# EAGLE design 601_motor_arduino (EAGLE 9.6.2)
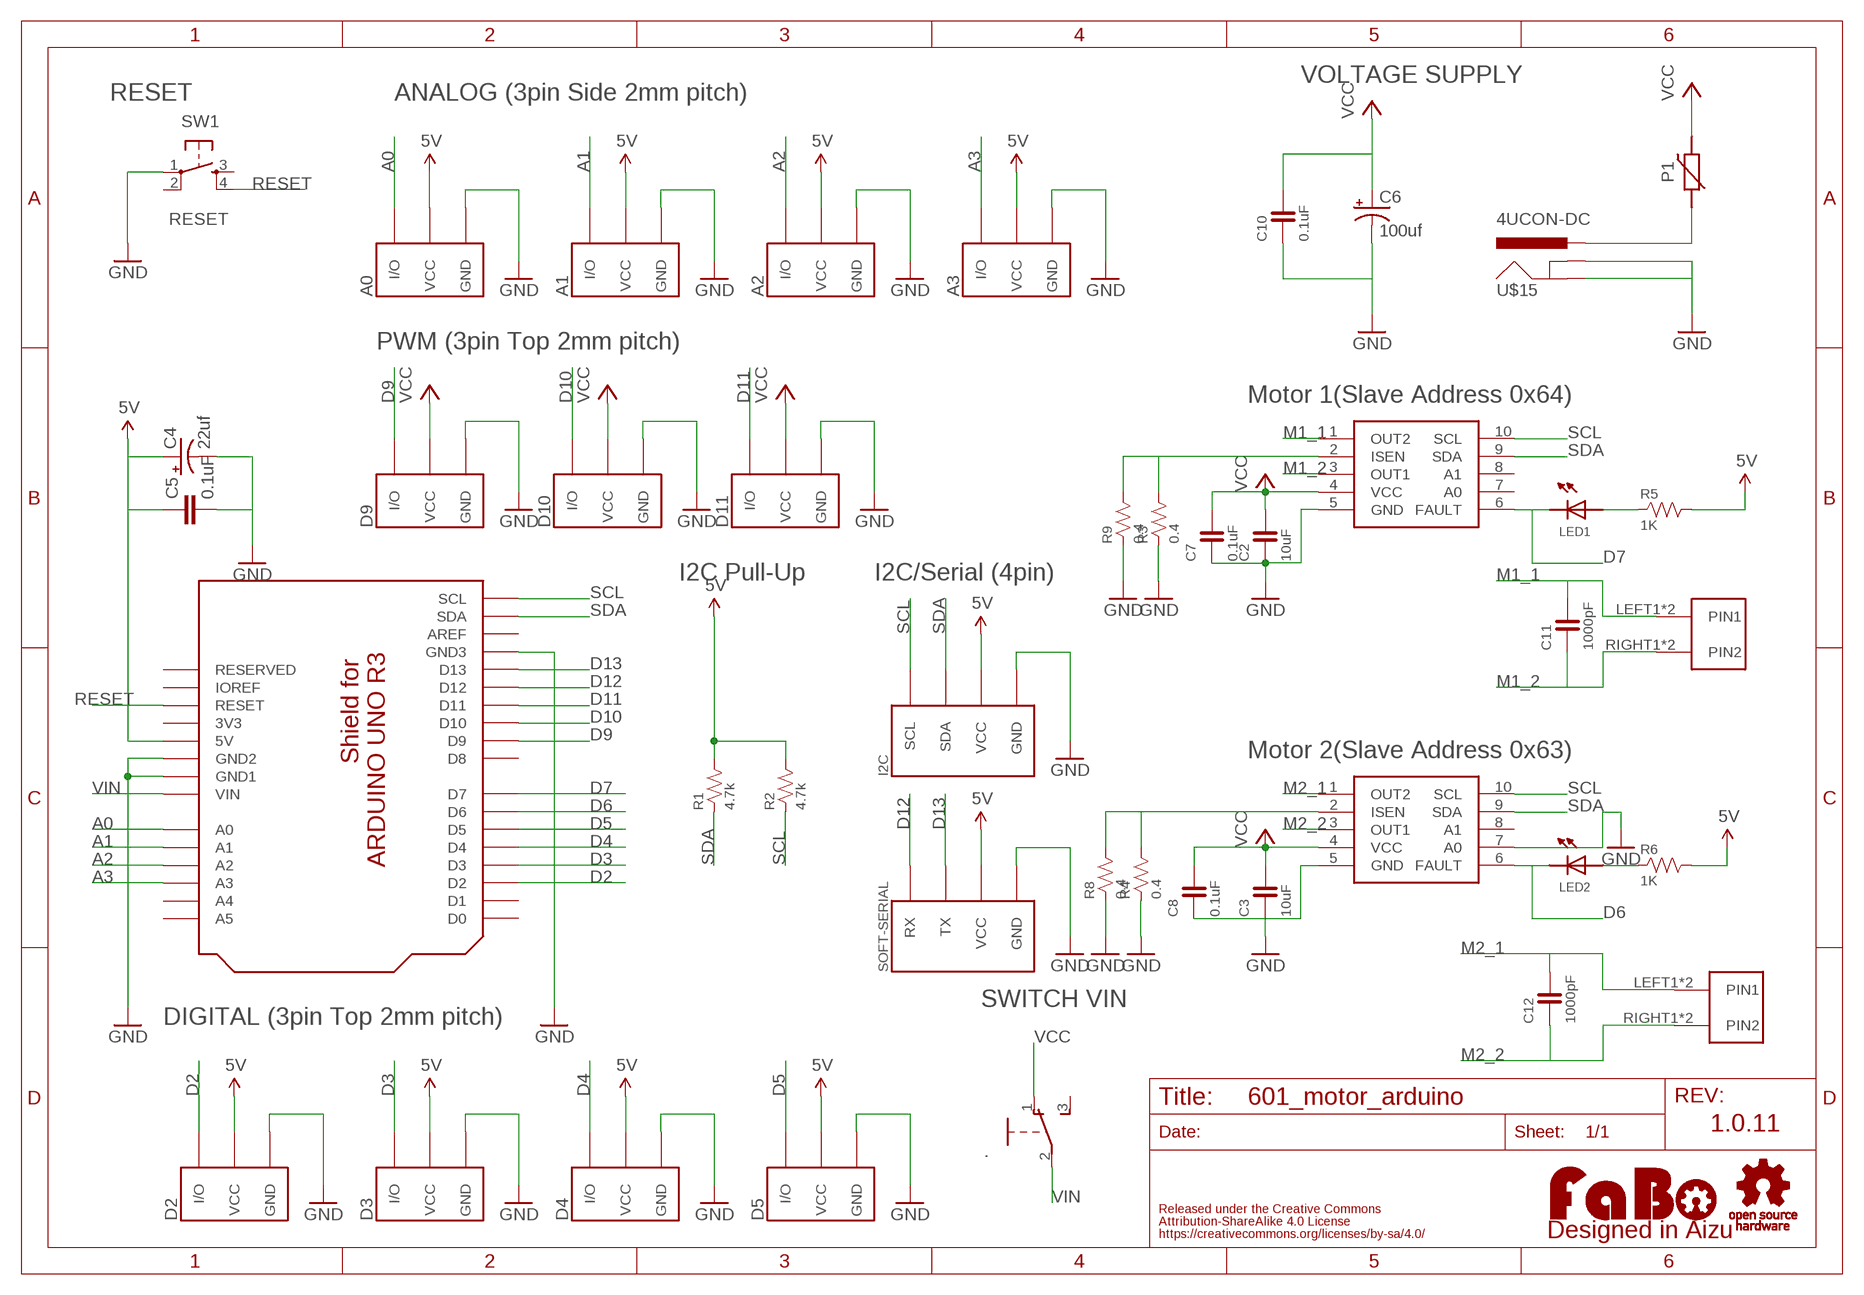
[diagram p0: schematic, sheet 1]

## Parts
.  SLIDE-EG1218  [EG1218]
A0  FABO_BRICK_3PIN-S03B-PASK-2  [FABO_BRICK_3PIN_S03B-PASK-2]
A1  FABO_BRICK_3PIN-S03B-PASK-2  [FABO_BRICK_3PIN_S03B-PASK-2]
A2  FABO_BRICK_3PIN-S03B-PASK-2  [FABO_BRICK_3PIN_S03B-PASK-2]
A3  FABO_BRICK_3PIN-S03B-PASK-2  [FABO_BRICK_3PIN_S03B-PASK-2]
C2  10uF  CAPACITOR-0603  [0603]
C3  10uF  CAPACITOR-0603  [0603]
C4  22uf  CPOL-US153CLV-0405  [153CLV-0405]
C5  0.1uF  CAP-EIA0603  [EIA0603]
C6  100uf  CPOL-US153CLV-0405  [153CLV-0405]
C7  0.1uF  CAPACITOR-0603  [0603]
C8  0.1uF  CAPACITOR-0603  [0603]
C10  0.1uF  CAPACITOR-0603  [0603]
C11  1000pF  CAPACITOR-0603  [0603]
C12  1000pF  CAPACITOR-0603  [0603]
D2  FABO_BRICK_3PIN-B03B-PASK-1  [FABO_BRICK_3PIN_B03B-PASK-1]
D3  FABO_BRICK_3PIN-B03B-PASK-1  [FABO_BRICK_3PIN_B03B-PASK-1]
D4  FABO_BRICK_3PIN-B03B-PASK-1  [FABO_BRICK_3PIN_B03B-PASK-1]
D5  FABO_BRICK_3PIN-B03B-PASK-1  [FABO_BRICK_3PIN_B03B-PASK-1]
D9  FABO_BRICK_3PIN-HEADER  [FABO_BRICK_3PIN_HEADER]
D10  FABO_BRICK_3PIN-HEADER  [FABO_BRICK_3PIN_HEADER]
D11  FABO_BRICK_3PIN-HEADER  [FABO_BRICK_3PIN_HEADER]
I2C  FABO_BRICK_I2C-S04B-PASK-2  [FABO_BRICK_I2C_S04B-PASK-2]
LED1  LED-0603  [0603]
LED2  LED-0603  [0603]
LOGO1  LOGO_FABO-M  [LOGO_FABO_M]
P1  POLYSWITCHMF-NSML1  [1206]
R1  4.7k  RESISTOR-0603  [0603]
R2  4.7k  RESISTOR-0603  [0603]
R3  0.4  RESISTOR-0603  [0603]
R4  0.4  RESISTOR-0603  [0603]
R5  1K  RESISTOR-0603  [0603]
R6  1K  RESISTOR-0603  [0603]
R8  0.4  RESISTOR-0603  [0603]
R9  0.4  RESISTOR-0603  [0603]
SOFT-SERIAL  FABO_BRICK_SERIAL-S04B-PASK-2  [FABO_BRICK_SERIAL_S04B-PASK-2]
SW1  RESET  SWITCH-TACT-6MM  [DTS_6_V]
U1  ARDUINO_UNO_R3_SHIELD-NOLABEL  [ARDUINO_UNO_R3_NOLABEL]
U$6  LOGO_OSHW-T_M  [LOGO_OSHW_T_MS]
U$8  DRV8830  [DRV8830]
U$10  DRV8830  [DRV8830]
U$12  ML-1400-S1  [ML-1400-S1]
U$13  ML-1400-S1  [ML-1400-S1]
U$15  4UCON-DC  [4UCON-DC]

## Nets
5V: A0.VCC A1.VCC A2.VCC A3.VCC C4.+ C5.1 D2.VCC D3.VCC D4.VCC D5.VCC I2C.VCC R1.2 R2.2 R5.2 R6.2 SOFT-SERIAL.VCC U1.5V
A0: A0.I/O U1.A0
A1: A1.I/O U1.A1
A2: A2.I/O U1.A2
A3: A3.I/O U1.A3
D2: D2.I/O U1.D2
D3: D3.I/O U1.D3
D4: D4.I/O U1.D4
D5: D5.I/O U1.D5
D6: LED2.CATHODE U1.D6 U$10.6(FAULT)
D7: LED1.CATHODE U1.D7 U$8.6(FAULT)
D9: D9.I/O U1.D9
D10: D10.I/O U1.D10
D11: D11.I/O U1.D11
D12: SOFT-SERIAL.RX U1.D12
D13: SOFT-SERIAL.TX U1.D13
GND: A0.GND A1.GND A2.GND A3.GND C2.1 C3.1 C4.- C5.2 C6.- C7.1 C8.1 C10.1 D2.GND D3.GND D4.GND D5.GND D9.GND D10.GND D11.GND I2C.GND R3.1 R4.1 R8.1 R9.1 SOFT-SERIAL.GND SW1.1 U1.GND1 U1.GND2 U1.GND3 U$8.5(GND) U$10.5(GND) U$10.7(A0) U$15.GND1(GND) U$15.GND2(GNDBREAK)
M1_1: C11.2 U$8.1(OUT2) U$12.LEFT1(PIN1) U$12.LEFT2(PIN1)
M1_2: C11.1 U$8.3(OUT1) U$12.RIGHT1(PIN2) U$12.RIGHT2(PIN2)
M2_1: C12.2 U$10.1(OUT2) U$13.LEFT1(PIN1) U$13.LEFT2(PIN1)
M2_2: C12.1 U$10.3(OUT1) U$13.RIGHT1(PIN2) U$13.RIGHT2(PIN2)
N$1: P1.P$1 U$15.VCC(PWR)
N$3: R3.2 R9.2 U$8.2(ISEN)
N$4: R4.2 R8.2 U$10.2(ISEN)
N$5: LED1.ANODE R5.1
N$6: LED2.ANODE R6.1
RESET: SW1.4 U1.RESET
SCL: I2C.SCL R2.1 U1.SCL U$8.10(SCL) U$10.10(SCL)
SDA: I2C.SDA R1.1 U1.SDA U$8.9(SDA) U$10.9(SDA)
VCC: ..1 C2.2 C3.2 C6.+ C7.2 C8.2 C10.2 D9.VCC D10.VCC D11.VCC P1.P$2 U$8.4(VCC) U$10.4(VCC)
VIN: ..2 U1.VIN
Unconnected: ..3 SW1.2 SW1.3 U1.A4 U1.A5 U1.AREF U1.D0 U1.D1 U1.D8 U1.IOREF U1.RESERVED U$8.7(A0) U$8.8(A1) U$10.8(A1)

## Notes on the sheet
- VOLTAGE SUPPLY
- RESET | ANALOG (3pin Side 2mm pitch)
- PWM (3pin Top 2mm pitch)
- Motor 1(Slave Address 0x64)
- I2C Pull-Up | I2C/Serial (4pin)
- Motor 2(Slave Address 0x63)
- SWITCH VIN
- DIGITAL (3pin Top 2mm pitch)
- 1.0.11

## Power pins joined to a net without a drawn wire
3V3: U1.3V3

## Library data of the parts
. = FaBo-Switch:SLIDE
A0 A1-A3 D2-D5 D9-D11 = FaBo-Template:FABO_BRICK_3PIN: FaBo Brick 3pin
C2 C3 C7 C8 C10-C12 = FaBo-Capacitor:CAPACITOR: CAPACITOR
C4 C6 = resistor:CPOL-US: POLARIZED CAPACITOR, American symbol
C5 = FaBo-etc:CAP: Capacitor Standard 0603 ceramic capacitor
I2C = FaBo-Template:FABO_BRICK_I2C: FaBo Brick I2C
LED1 LED2 = FaBo-LED:LED
LOGO1 = component:LOGO_FABO
P1 = FaBo-Supply:POLYSWITCH
R1-R6 R8 R9 = FaBo-Resistors:RESISTOR: RESISTOR
SOFT-SERIAL = FaBo-Template:FABO_BRICK_SERIAL: FaBo Brick Serial
SW1 = FaBo-etc:SWITCH-TACT
U1 = FaBo-Boards:ARDUINO_UNO_R3_SHIELD
U$6 = FaBo-etc:LOGO_OSHW
U$8 U$10 = FaBo-Motor:DRV8830
U$12 U$13 = FaBo-Terminal:ML-1400-S1
U$15 = FaBo-Supply:4UCON-DC

## Board
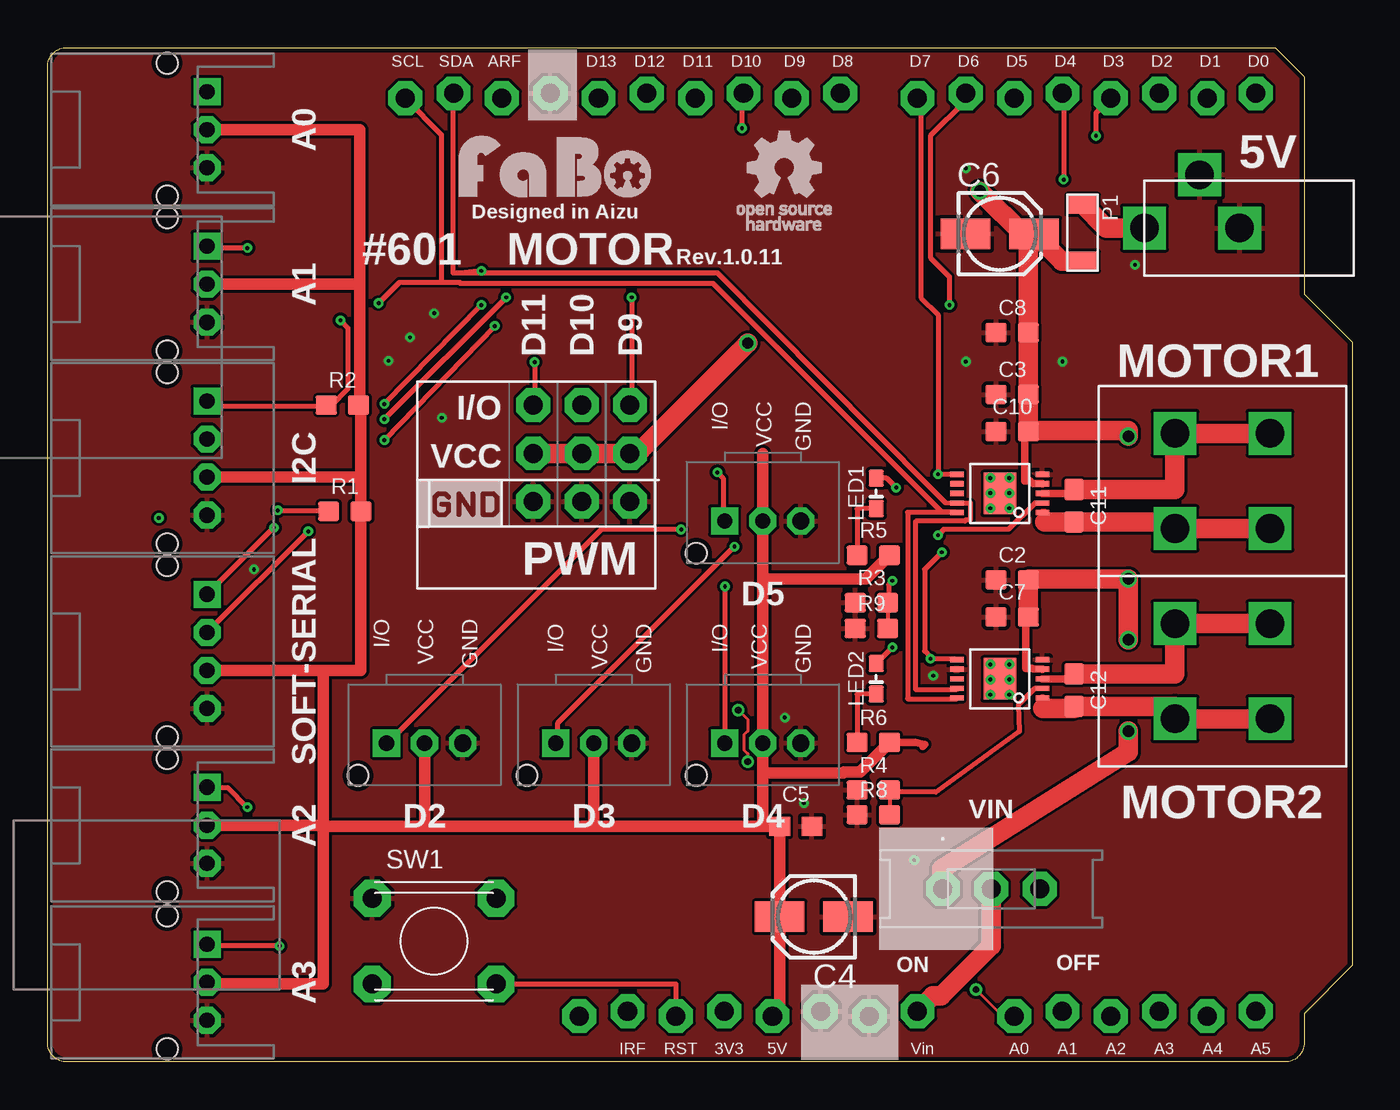
[diagram p1: board, top side]
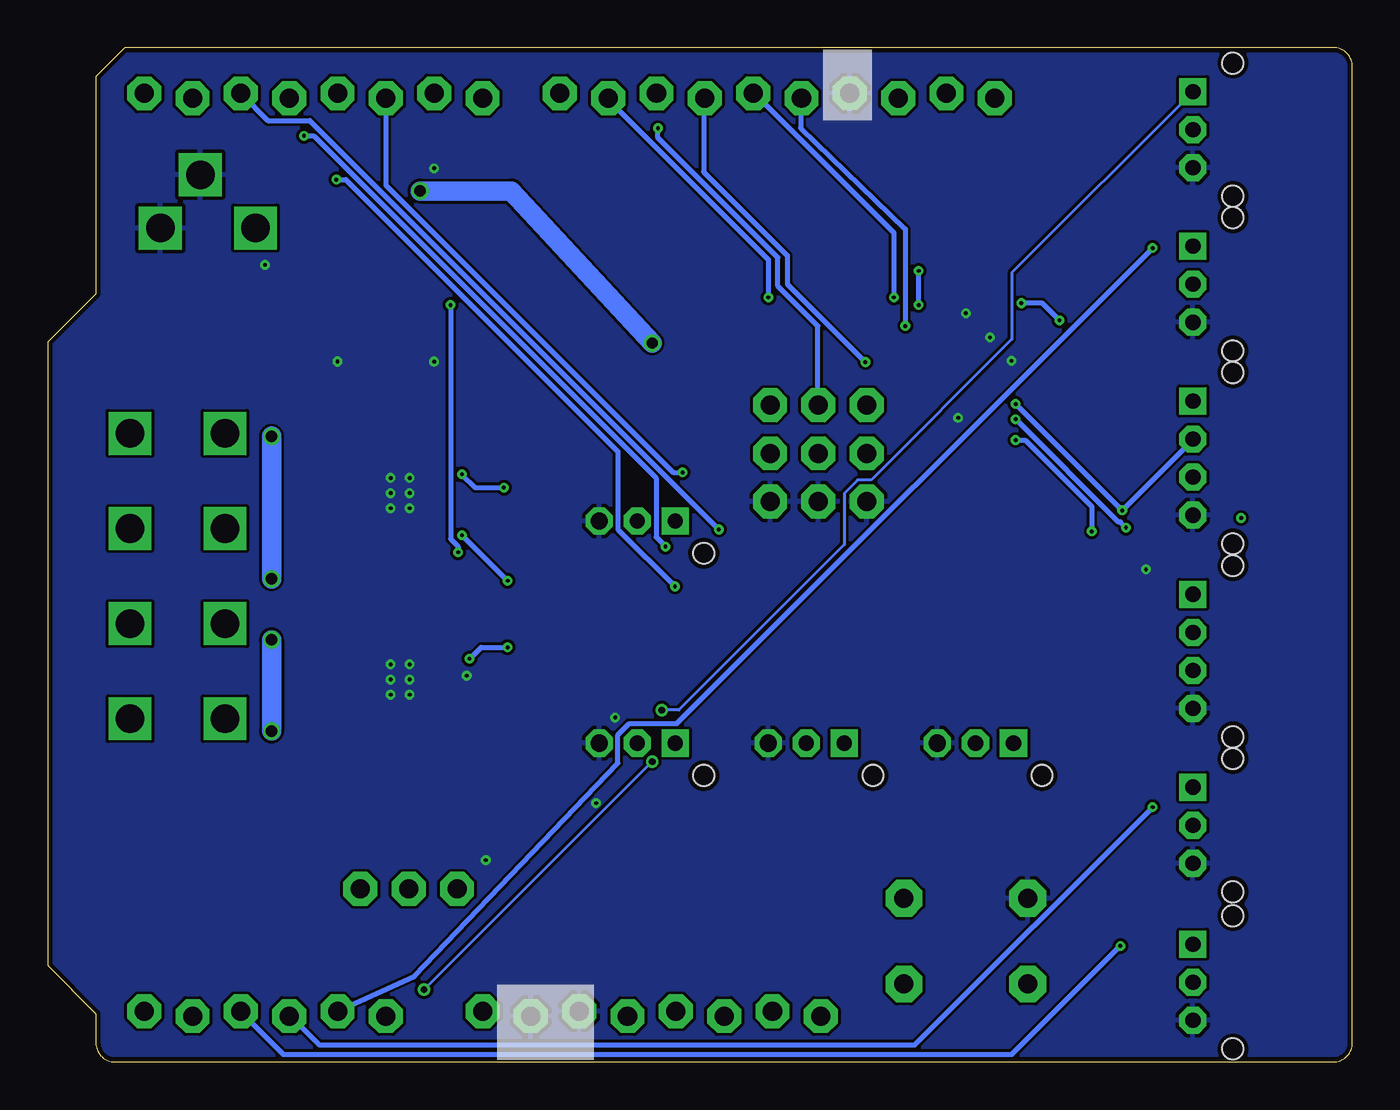
[diagram p2: board, bottom side, seen from below]

Size 68.58 x 53.34 mm. Coordinates in mm from the lower left corner, seen from the top.
Copper layers (1*16): Top 0.035mm / dielectric 1.6mm / Bottom 0.035mm
Design rules "PCBway": minimum track width 6mil, minimum drill 12mil, track to track 6mil, track to pad 6mil, pad to pad 6mil, via to via 6mil, smd to smd 6mil, copper to edge 10mil, drill to drill 10mil, minimum pad ring 10mil, minimum via ring 6mil, stop-mask expansion 2mil, vias tented up to drill 100mil, thermal gap 8mil

### Footprints (pad centres in the part's own frame; a part is rotated, then mirrored left to right if it is on the bottom)
EG1218 = drill 1 pad 1.778 octagon: 1 -2.54,0; 2 0,0; 3 2.54,0
FABO_BRICK_3PIN_S03B-PASK-2 = drill 0.8 pad 1.422 octagon: GND -2,0; VCC 0,0 | drill 0.8 pad 1.422 square: I/O 2,0 | hole 1.1: 3.5,2.1; -3.5,2.1
0603 = smd 1.1 x 1: 1 -0.85,0; 2 0.85,0
153CLV-0405 = smd 2.6 x 1.6: + 1.8,0; - -1.8,0
EIA0603 = smd 1.1 x 1: 1 -0.85,0; 2 0.85,0
FABO_BRICK_3PIN_B03B-PASK-1 = drill 0.9 pad 1.422 octagon: GND -2,0 | drill 0.8 pad 1.422 square: I/O 2,0 | drill 0.8 pad 1.422 octagon: VCC 0,0 | hole 1.1: 3.5,1.7
FABO_BRICK_3PIN_HEADER = drill 1 pad 1.778 octagon: GND -2.54,0; I/O 2.54,0; VCC 0,0
FABO_BRICK_I2C_S04B-PASK-2 = drill 0.8 pad 1.422 octagon: GND -3,0; SDA 1,0; VCC -1,0 | drill 0.8 pad 1.422 square: SCL 3,0 | hole 1.1: 4.5,2.1; -4.5,2.1
0603' = smd 0.9 x 0.8: ANODE -0.8,0; CATHODE 0.8,0
1206 = smd 1 x 1.6: P$1 -1.5,0; P$2 1.5,0
FABO_BRICK_SERIAL_S04B-PASK-2 = drill 0.8 pad 1.422 octagon: GND -3,0; TX 1,0; VCC -1,0 | drill 0.8 pad 1.422 square: RX 3,0 | hole 1.1: 4.5,2.1; -4.5,2.1
DTS_6_V = drill 1 pad 1.93 octagon: 1 -3.25,2.25; 2 3.25,2.25; 3 -3.25,-2.25; 4 3.25,-2.25
ARDUINO_UNO_R3_NOLABEL = drill 1 pad 1.778 octagon: 3V3 35.56,2.667; 5V 38.1,2.413; A0 50.8,2.413; A1 53.34,2.667; A2 55.88,2.413; A3 58.42,2.667; A4 60.96,2.413; A5 63.5,2.667; AREF 23.876,50.673; D0 63.5,50.927; D1 60.96,50.673; D2 58.42,50.927; D3 55.88,50.673; D4 53.34,50.927; D5 50.8,50.673; D6 48.26,50.927; D7 45.72,50.673; D8 41.656,50.927; D9 39.116,50.673; D10 36.576,50.927; D11 34.036,50.673; D12 31.496,50.927; D13 28.956,50.673; GND1 43.18,2.413; GND2 40.64,2.667; GND3 26.416,50.927; IOREF 30.48,2.667; RESERVED 27.94,2.413; RESET 33.02,2.413; SCL 18.796,50.673; SDA 21.336,50.927; VIN 45.72,2.667
DRV8830 = smd 0.27 x 0.7: 1 -1,-2.24; 2 -0.5,-2.24; 3 0,-2.24; 4 0.5,-2.24; 5 1,-2.24; 6 1,2.26; 7 0.5,2.26; 8 0,2.26; 9 -0.5,2.26; 10 -1,2.26 | smd 2.18 x 1.72: P$1 0,0
ML-1400-S1 = drill 1.5 square: LEFT1 -2.5,2.5; LEFT2 -2.5,-2.5; RIGHT1 2.5,2.5; RIGHT2 2.5,-2.5
4UCON-DC = drill 1.5 square: GND1 0.5,0; GND2 2.6,-2.8; VCC 5.5,0

### Placement (x,y rotation side)
.  49.6,9.1 0 top
A0  8.38,49.02 90 top
A1  8.38,40.89 90 top
A2  8.38,12.45 90 top
A3  8.38,4.19 90 top
C2  50.7,25.35 0 top
C3  50.7,35.1 0 top
C4  40.28,7.64 180 top
C5  39.33,12.38 0 top
C6  50.05,43.55 0 top
C7  50.7,23.4 0 top
C8  50.7,38.35 0 top
C10  50.7,33.15 0 top
C11  53.95,29.25 270 top
C12  53.95,19.55 270 top
D2  19.81,16.76 180 top
D3  28.7,16.76 180 top
D4  37.59,16.76 180 top
D5  37.59,28.45 180 top
D9  30.61,32 90 top
D10  28.07,32 90 top
D11  25.53,32 90 top
I2C  8.38,31.75 90 top
LED1  [0603']  43.55,29.9 90 top
LED2  [0603']  43.55,20.15 90 top
LOGO1  26.67,45.09 0 top
P1  54.4,43.6 270 top
R1  15.62,28.96 0 top
R2  15.49,34.54 0 top
R3  43.3,24.15 0 top
R4  43.4,14.3 0 top
R5  43.4,26.65 0 top
R6  43.4,16.8 0 top
R8  43.4,13 0 top
R9  43.3,22.8 0 top
SOFT-SERIAL  8.38,21.59 90 top
SW1  20.32,6.35 0 top
U1  0,0 0 top
U$6  38.73,46.99 0 top
U$8  50.05,29.9 90 top
U$10  50.05,20.15 90 top
U$12  61.75,30.55 90 top
U$13  61.75,20.55 90 top
U$15  63.15,43.85 180 top
U$19  [LOGO_SILK_GND]  20.07,28.07 0 top

### Tracks (layer width: path | path; a pad name or v marks a point on that pad's centre or on a via)
5V
  Top 0.406: 46,16.6 46.1,16.7 45.6,16.8 R6.2
  Top 0.61: U1.5V 38.48,2.41 C4.+ C5.1 37.59,12.38 | 37.59,12.38 37.59,15.2 | 37.59,15.2 D4.VCC 37.59,25.4 | 37.59,12.38 28.7,12.38 | 28.7,12.38 D3.VCC | 28.7,12.38 19.81,12.38 | 19.81,12.38 D2.VCC | 37.59,25.4 D5.VCC 37.59,32 | 37.59,15.2 41.81,15.2 41.87,15.26 42.71,15.26 R6.2 | 37.59,25.4 43,25.4 R5.2 | 14.5,12.38 19.81,12.38 | 14.5,12.38 14.5,4.1 8.38,4.1 A3.VCC | 14.5,12.45 A2.VCC | 14.5,12.45 14.5,12.38 | SOFT-SERIAL.VCC 14.5,20.59 | 14.5,20.59 14.5,12.45 | 14.5,20.59 16.47,20.59 R1.2 16.47,30.75 | 16.47,30.75 16.47,34.54 R2.2 16.4,34.54 16.4,40.89 | I2C.VCC 16.47,30.75 | 16.4,40.89 A1.VCC | A0.VCC 16.4,49.02 16.4,40.89
A0  (via drill 0.35)
  Top 0.152: v48.8,3.8 50.1,2.5 50.8,2.5 U1.A0 | v36.8,15.8 36.8,16.2 36.6,16.4 36.6,17.2 36.8,17.4 36.8,18 v36.3,18.5
  Bottom 0.152: v36.8,15.8 v48.8,3.8 | v36.3,18.5 35.4,18.5 26.7,27.2 26.7,29.9 26,30.6 25.3,30.6 17.9,38 17.9,41.5 8.4,51 A0.I/O
A1  (via drill 0.2)
  Top 0.254: v10.5,42.8 8.4,42.8 A1.I/O
  Bottom 0.254: v10.5,42.8 35.5,17.8 38,17.8 38.6,17.2 38.6,15.7 49.3,4.5 53.3,2.7 U1.A1
A2  (via drill 0.2)
  Top 0.254: v10.5,13.4 9.5,14.4 8.4,14.4 A2.I/O
  Bottom 0.254: v10.5,13.4 23,0.9 54.3,0.9 55.8,2.4 U1.A2
A3  (via drill 0.2)
  Top 0.254: v12.2,6.1 8.4,6.1 A3.I/O
  Bottom 0.254: v12.2,6.1 17.9,0.4 56.2,0.4 58.4,2.6 U1.A3
D2  (via drill 0.2)
  Top 0.254: v33.3,28 29.1,28 17.9,16.8 D2.I/O
  Bottom 0.254: v33.3,28 54.8,49.5 57,49.5 58.4,50.9 U1.D2
D3  (via drill 0.2)
  Top 0.254: v36.1,27.1 26.8,17.8 26.8,16.8 D3.I/O | v55.1,48.7 55.1,49.9 55.8,50.6 U1.D3
  Bottom 0.254: v36.1,27.1 36.6,27.6 36.6,30.7 54.6,48.7 v55.1,48.7
D4  (via drill 0.2)
  Top 0.254: v35.6,25 35.6,16.8 D4.I/O | v53.4,46.4 53.4,50.9 U1.D4
  Bottom 0.254: v35.6,25 38.6,28 38.6,32.1 52.9,46.4 v53.4,46.4
D5  (via drill 0.2)
  Top 0.254: v35.2,31 35.5,30.7 35.5,28.5 D5.I/O
  Bottom 0.254: v35.2,31 35.7,31 50.8,46.1 U1.D5
D6  (via drill 0.2)
  Top 0.254: v44.4,21.8 LED2.CATHODE | U$10.6 47.7,21.2 v46.4,21.2 46.4,21.3 46.1,21.6 46.1,25.9 v47,26.8 | v47.4,39.8 47.4,41.3 46.4,42.3 46.4,48.7 48.2,50.5 48.2,50.9 U1.D6
  Bottom 0.254: v44.4,21.8 45.8,21.8 v46.4,21.2 | v47,26.8 47,27.1 47.4,27.5 v47.4,39.8
D7  (via drill 0.2)
  Top 0.254: LED1.CATHODE 44.1,30.7 v44.6,30.2 | U$8.6 v46.8,30.9 46.8,39.3 45.9,40.2 45.9,50.5 45.8,50.6 U1.D7
  Bottom 0.254: v44.6,30.2 46.1,30.2 v46.8,30.9
D9  (via drill 0.2)
  Top 0.254: v30.7,40.2 30.7,34.6 D9.I/O
  Bottom 0.254: v30.7,40.2 30.7,42.2 39.1,50.6 U1.D9
D10  (via drill 0.2)
  Top 0.254: v36.5,49.1 36.5,50.9 U1.D10
  Bottom 0.254: v36.5,49.1 36.5,48.6 30.2,42.3 30.2,40.8 28.1,38.7 28.1,34.6 D10.I/O
D11  (via drill 0.2)
  Top 0.254: v25.6,36.8 25.6,34.6 D11.I/O
  Bottom 0.254: v25.6,36.8 29.7,40.9 29.7,42.4 34.1,46.8 34.1,50.6 U1.D11
D12  (via drill 0.2)
  Top 0.254: v11.9,28.1 8.4,24.6 SOFT-SERIAL.RX | v24.1,40.2 v17.7,33.8
  Bottom 0.254: v11.9,28.1 12.2,28.4 12.3,28.4 v17.7,33.8 | v24.1,40.2 24.1,43.6 31.4,50.9 U1.D12
D13  (via drill 0.2)
  Top 0.254: v13.7,27.9 8.4,22.6 SOFT-SERIAL.TX | v23.5,38.7 v17.7,32.7
  Bottom 0.254: v13.7,27.9 13.7,29.2 17.2,32.7 v17.7,32.7 | v23.5,38.7 23.5,43.8 29,49.1 29,50.6 U1.D13
GND  (via drill 0.2)
  other vias: 57.15,41.91 53.34,36.83 48.26,36.83 48.26,46.99 20.32,39.37 19.05,38.1 10.85,25.9 49.55,30.71 49.55,29.91 49.55,29.11 50.55,29.11 50.55,29.91 50.55,30.71 50.55,20.91 49.55,20.91 49.55,20.11 50.55,20.11 50.55,19.31 49.55,19.31 46.55,20.31 45.55,10.61 38.75,18.11 17.92,36.87 20.72,33.87 39.75,13.61
  pour Bottom: 0,0 68.58,0 68.58,53.34 0,53.34
  pour Top: 0,0 68.58,0 68.58,53.34 0,53.34
M1_1
  Top 0.406: U$8.1 52.4,28.9 52.4,28.4
  Top 1.016: 52.4,28.4 C11.2 59.25,28.4 U$12.LEFT1 U$12.LEFT2
M1_2
  Top 0.406: U$8.3 53.95,29.9 C11.1
  Top 1.016: C11.1 59.25,30.1 59.25,32.5 | 59.25,32.5 U$12.RIGHT1 | U$12.RIGHT2 U$12.RIGHT1 | U$12.RIGHT1 59.25,32.5
M2_1
  Top 0.406: U$10.1 52.3,18.6 | 53.95,18.6 C12.2
  Top 1.016: 52.3,18.6 53.95,18.6 | C12.2 59.25,18.7 U$13.LEFT1 U$13.LEFT2
M2_2
  Top 0.406: U$10.3 53.95,20.15 C12.1
  Top 1.016: C12.1 59.25,20.4 U$13.RIGHT1 U$13.RIGHT2
N$1
  Top 1.016: U$15.VCC 55.65,43.85 P1.P$1
N$3  (via drill 0.2)
  Top 0.203: R3.2 R9.2
  Top 0.254: v44.4,25.3 44.2,25.1 44.2,24.2 R3.2 | v46.8,27.7 47.1,28 50.5,28 51.9,29.4 U$8.2
  Bottom 0.254: v46.8,27.7 v44.4,25.3
N$4
  Top 0.203: R4.2 R8.2
  Top 0.254: U$10.2 51.9,19.65 51.03,18.78 51.08,17.38 46.7,14.2 44.25,14.2 R4.2
N$5
  Top 0.254: LED1.ANODE 42.55,29.1 R5.1
N$6
  Top 0.254: LED2.ANODE 42.55,19.35 R6.1
N$7  (via drill 0.2)
  other vias: 5.85,28.6
RESET
  Top 0.254: SW1.4 33.02,4.1 U1.RESET
SCL  (via drill 0.2)
  Top 0.254: U1.SCL 20.7,48.77 20.7,41 | 47.69,28.94 46.97,28.94 46.91,29.01 | 46.91,29.01 34.97,40.94 21.67,40.94 21.67,41 20.7,41 | U$8.10 46.9,28.9 | 46.9,28.9 45.2,28.9 45.2,19.1 47.79,19.1 U$10.10 | I2C.SCL 8.4,34.7 8.6,34.5 14.6,34.5 R2.1 14.7,34.5 14.9,34.5 15.8,35.4 15.8,38.6 v15.4,39 | 20.7,41 18.5,41 v17.4,39.9 | 46.91,29.01 46.9,29 46.9,28.9
  Bottom 0.254: v17.4,39.9 16.3,39.9 v15.4,39
SDA  (via drill 0.2)
  Top 0.254: 21.3,50.93 21.3,41.5 21.9,41.5 | 21.9,41.5 35.2,41.5 46.39,30.21 47.18,29.41 U$8.9 48.5,29.4 48.5,28.5 48.27,28.5 48.2,28.43 45.64,28.43 45.61,28.4 45.61,19.6 47.79,19.6 U$10.9 | v12.1,29 14.7,29 R1.1 | v17.7,34.6 v22.8,39.8 | v22.8,41.6 21.9,41.5
  Top 0.406: U1.SDA 21.3,50.93
  Bottom 0.254: I2C.SDA 8.4,32.7 v12.1,29 v17.7,34.6 | v22.8,39.8 v22.8,41.6
VCC  (via drill 0.6)
  Top 0.406: C10.2 51.35,33.15 51.35,30.55 51.65,30.55 51.79,30.41 U$8.4 | C7.2 51.4,23.4 51.4,20.7 51.75,20.7 51.79,20.66 U$10.4 | 51.4,43.4 C6.+ | 31.2,32.2 30.8,32.2 D9.VCC | 28.2,32 D10.VCC 28,32 | 25.6,32 D11.VCC
  Top 1.016: v56.8,32.9 56.8,33.2 52,33.2 C10.2 C3.2 C8.2 51.55,43.55 C6.+ 53.3,42.1 P1.P$2 | C7.2 C2.2 51.6,25.4 v56.8,25.4 v56.8,22.2 | v56.8,17.4 56.8,16.3 47,10.16 ..1 | 51.4,43.4 v49,45.8 | v36.8,37.8 31.2,32.2 | D9.VCC 28.2,32 | 25.6,32 28,32
  Bottom 1.016: v56.8,25.4 v56.8,32.9 | v56.8,22.2 v56.8,17.4 | v49,45.8 44.2,45.8 v36.8,37.8
VIN
  Top 1.016: ..2 49.6,6.1 46.97,3.47 46.52,3.47 U1.VIN

### Text on the board
tPlace: SCL | SDA | ARF | D13 | D12 | D11 | D10 | D9 | D8 | D7 | D6 | D5 | D4 | D3 | D2 | D1 | D0 | 5V | Designed in Aizu | #601 | MOTOR | Rev.1.0.11 | MOTOR1 | I/O | VCC | GND | I/O | VCC | PWM | I/O | VCC | GND | I/O | VCC | GND | I/O | VCC | GND | VIN | MOTOR2 | ON | OFF | IRF | RST | 3V3 | 5V | Vin | A0 | A1 | A2 | A3 | A4 | A5